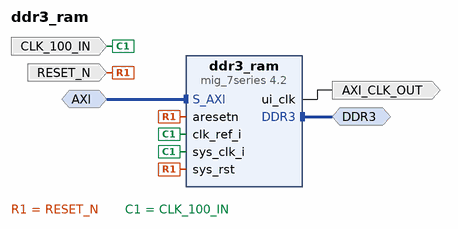
[diagram p0: block diagram of the top level]
# Vivado block design ddr3_ram, xc7a35tftg256-1, Vivado 2020.2.2
create_bd_design ddr3_ram

create_bd_intf_port -mode Slave -vlnv xilinx.com:interface:aximm_rtl:1.0 AXI
set_property -dict [list \
  CONFIG.ADDR_WIDTH 28 \
  CONFIG.ARUSER_WIDTH 0 \
  CONFIG.AWUSER_WIDTH 0 \
  CONFIG.BUSER_WIDTH 0 \
  CONFIG.DATA_WIDTH 32 \
  CONFIG.HAS_BRESP 1 \
  CONFIG.HAS_BURST 1 \
  CONFIG.HAS_CACHE 1 \
  CONFIG.HAS_LOCK 1 \
  CONFIG.HAS_PROT 1 \
  CONFIG.HAS_QOS 1 \
  CONFIG.HAS_REGION 0 \
  CONFIG.HAS_RRESP 1 \
  CONFIG.HAS_WSTRB 1 \
  CONFIG.ID_WIDTH 4 \
  CONFIG.MAX_BURST_LENGTH 256 \
  CONFIG.NUM_READ_OUTSTANDING 8 \
  CONFIG.NUM_READ_THREADS 1 \
  CONFIG.NUM_WRITE_OUTSTANDING 8 \
  CONFIG.NUM_WRITE_THREADS 1 \
  CONFIG.PROTOCOL AXI4 \
  CONFIG.READ_WRITE_MODE READ_WRITE \
  CONFIG.RUSER_BITS_PER_BYTE 0 \
  CONFIG.RUSER_WIDTH 0 \
  CONFIG.SUPPORTS_NARROW_BURST 1 \
  CONFIG.WUSER_BITS_PER_BYTE 0 \
  CONFIG.WUSER_WIDTH 0 \
] [get_bd_intf_ports AXI]
create_bd_intf_port -mode Master -vlnv xilinx.com:interface:ddrx_rtl:1.0 DDR3
create_bd_port -dir O -type clk AXI_CLK_OUT
create_bd_port -dir I -type rst RESET_N
create_bd_port -dir I -type clk CLK_100_IN

create_bd_cell -type ip -vlnv xilinx.com:ip:mig_7series:4.2 ddr3_ram
set_property -dict [list \
  CONFIG.BOARD_MIG_PARAM Custom \
  CONFIG.MIG_DONT_TOUCH_PARAM Custom \
  CONFIG.RESET_BOARD_INTERFACE Custom \
  CONFIG.XML_INPUT_FILE mig_b.prj \
] [get_bd_cells ddr3_ram]

# ---- connections ----

connect_bd_intf_net -intf_net S_AXI_0_1 [get_bd_intf_ports AXI] [get_bd_intf_pins ddr3_ram/S_AXI]
connect_bd_intf_net -intf_net mig_7series_0_DDR3 [get_bd_intf_ports DDR3] [get_bd_intf_pins ddr3_ram/DDR3]
connect_bd_net -net mig_7series_0_ui_clk [get_bd_pins ddr3_ram/ui_clk] [get_bd_ports AXI_CLK_OUT]
connect_bd_net -net aresetn_0_1 [get_bd_ports RESET_N] [get_bd_pins ddr3_ram/aresetn] [get_bd_pins ddr3_ram/sys_rst]
connect_bd_net -net clk_ref_i_0_1 [get_bd_ports CLK_100_IN] [get_bd_pins ddr3_ram/clk_ref_i] [get_bd_pins ddr3_ram/sys_clk_i]

# ---- address map ----
assign_bd_address -offset 0x0000000 -range 256M -target_address_space [get_bd_addr_spaces AXI] [get_bd_addr_segs ddr3_ram/memmap/memaddr]

validate_bd_design
save_bd_design
